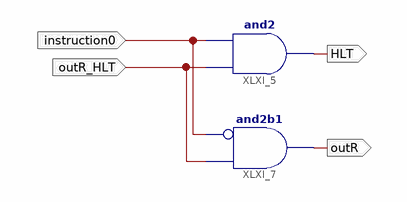
[diagram p0: schematic sheet 1]
// Xilinx ISE schematic outR_HLT.sch (spartan6) as structural Verilog: 2 symbols, 4 ports
module outR_HLT (
  input  instruction0,
  input  outR_HLT,
  output HLT,
  output outR
);

  and XLXI_5 (HLT, outR_HLT, instruction0);
  and XLXI_7 (outR, ~instruction0, outR_HLT);  // and2b1
endmodule
